# EAGLE design LSGTB (EAGLE 6.5.0)
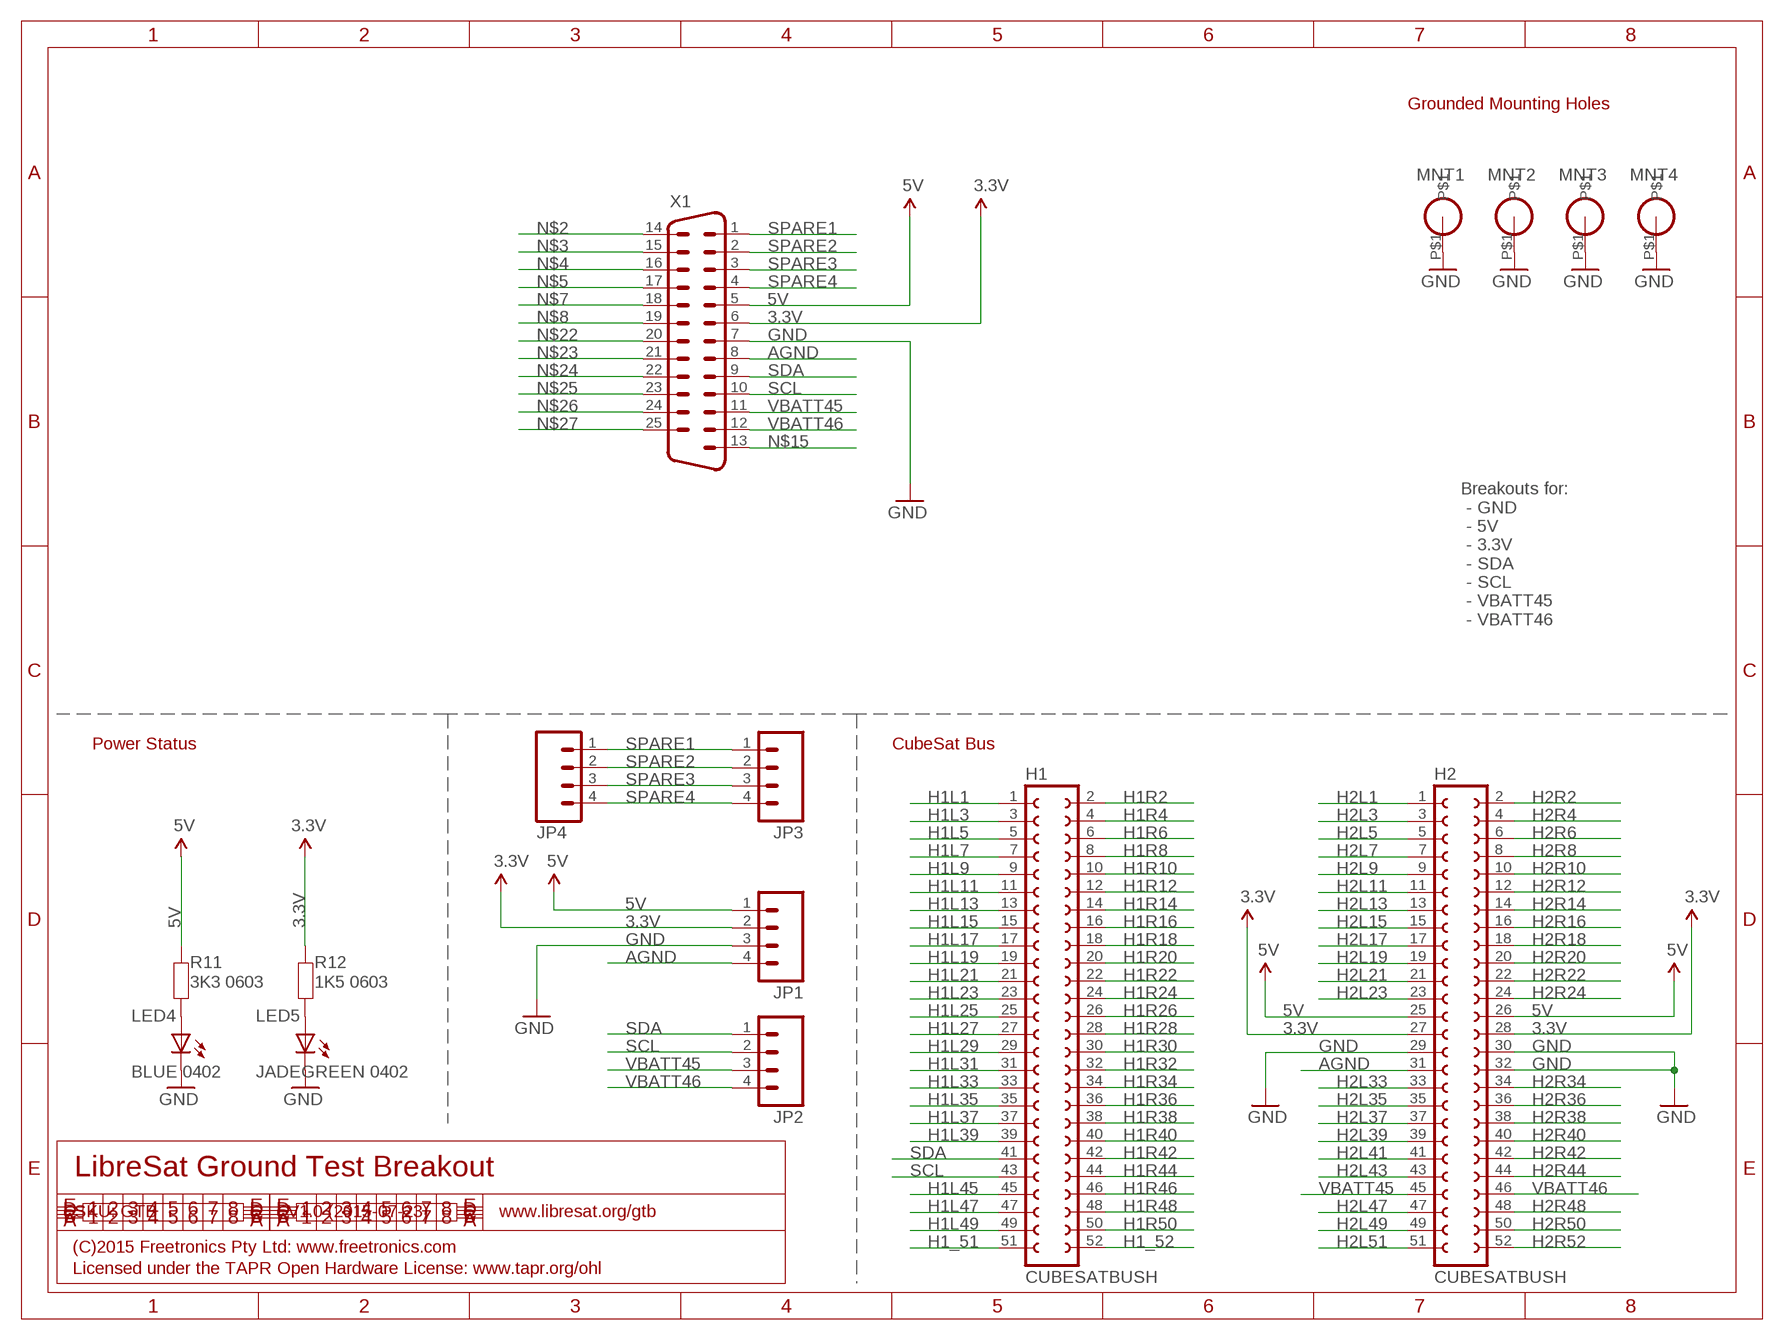
[diagram p0: schematic, sheet 1]

## Parts
H1  CUBESATBUSH  [CUBESATBUS]
H2  CUBESATBUSH  [CUBESATBUS]
JP1  M04SCREW  [SCREWTERMINAL-3.5MM-4]
JP2  M04SCREW  [SCREWTERMINAL-3.5MM-4]
JP3  M04SCREW  [SCREWTERMINAL-3.5MM-4]
JP4  M04PTH  [1X04]
LED4  BLUE 0402  LED0603  [LED-0603]
LED5  JADEGREEN 0402  LED0603  [LED-0603]
MNT1  HOLE3.2MM  [HOLE32]
MNT2  HOLE3.2MM  [HOLE32]
MNT3  HOLE3.2MM  [HOLE32]
MNT4  HOLE3.2MM  [HOLE32]
R11  3K3 0603  RESISTOR0603  [0603]
R12  1K5 0603  RESISTOR0603  [0603]
X1  DB25HP  [M25HP]

## Nets
3.3V: H2.27 H2.28 JP1.2 R12.1 X1.6
5V: H2.25 H2.26 JP1.1 R11.1 X1.5
AGND: H2.31 JP1.4 X1.8
GND: H2.29 H2.30 H2.32 JP1.3 LED4.C LED5.C MNT1.P$1 MNT2.P$1 MNT3.P$1 MNT4.P$1 X1.7
H1_51: H1.51
H1_52: H1.52
H1L1: H1.1
H1L3: H1.3
H1L5: H1.5
H1L7: H1.7
H1L9: H1.9
H1L11: H1.11
H1L13: H1.13
H1L15: H1.15
H1L17: H1.17
H1L19: H1.19
H1L21: H1.21
H1L23: H1.23
H1L25: H1.25
H1L27: H1.27
H1L29: H1.29
H1L31: H1.31
H1L33: H1.33
H1L35: H1.35
H1L37: H1.37
H1L39: H1.39
H1L45: H1.45
H1L47: H1.47
H1L49: H1.49
H1R2: H1.2
H1R4: H1.4
H1R6: H1.6
H1R8: H1.8
H1R10: H1.10
H1R12: H1.12
H1R14: H1.14
H1R16: H1.16
H1R18: H1.18
H1R20: H1.20
H1R22: H1.22
H1R24: H1.24
H1R26: H1.26
H1R28: H1.28
H1R30: H1.30
H1R32: H1.32
H1R34: H1.34
H1R36: H1.36
H1R38: H1.38
H1R40: H1.40
H1R42: H1.42
H1R44: H1.44
H1R46: H1.46
H1R48: H1.48
H1R50: H1.50
H2L1: H2.1
H2L3: H2.3
H2L5: H2.5
H2L7: H2.7
H2L9: H2.9
H2L11: H2.11
H2L13: H2.13
H2L15: H2.15
H2L17: H2.17
H2L19: H2.19
H2L21: H2.21
H2L23: H2.23
H2L33: H2.33
H2L35: H2.35
H2L37: H2.37
H2L39: H2.39
H2L41: H2.41
H2L43: H2.43
H2L47: H2.47
H2L49: H2.49
H2L51: H2.51
H2R2: H2.2
H2R4: H2.4
H2R6: H2.6
H2R8: H2.8
H2R10: H2.10
H2R12: H2.12
H2R14: H2.14
H2R16: H2.16
H2R18: H2.18
H2R20: H2.20
H2R22: H2.22
H2R24: H2.24
H2R34: H2.34
H2R36: H2.36
H2R38: H2.38
H2R40: H2.40
H2R42: H2.42
H2R44: H2.44
H2R48: H2.48
H2R50: H2.50
H2R52: H2.52
N$1: LED5.A R12.2
N$2: X1.14
N$3: X1.15
N$4: X1.16
N$5: X1.17
N$6: LED4.A R11.2
N$7: X1.18
N$8: X1.19
N$15: X1.13
N$22: X1.20
N$23: X1.21
N$24: X1.22
N$25: X1.23
N$26: X1.24
N$27: X1.25
SCL: H1.43 JP2.2 X1.10
SDA: H1.41 JP2.1 X1.9
SPARE1: JP3.1 JP4.1 X1.1
SPARE2: JP3.2 JP4.2 X1.2
SPARE3: JP3.3 JP4.3 X1.3
SPARE4: JP3.4 JP4.4 X1.4
VBATT45: H2.45 JP2.3 X1.11
VBATT46: H2.46 JP2.4 X1.12

## Notes on the sheet
- Grounded Mounting Holes
- Breakouts for:
   - GND
   - 5V
   - 3.3V
   - SDA
   - SCL
   - VBATT45
   - VBATT46
- Power Status | CubeSat Bus
- LibreSat Ground Test Breakout
- SKU: GTB | V1.0 (2015-07-23) | www.libresat.org/gtb
- (C)2015 Freetronics Pty Ltd: www.freetronics.com
- Licensed under the TAPR Open Hardware License: www.tapr.org/ohl

## Library data of the parts
H1 H2 = freetronics-jon:CUBESATBUS
JP1-JP4 = freetronics-original:M04: Header 4 Standard 4-pin 0.1" header. Use with straight break away headers (SKU : PRT-00116), right angle break away headers (PRT-00553), swiss pins (PRT-00743), machine pins (PRT-00117), and female headers (PRT-00115). Molex polarized connector foot print use with SKU : PRT-08231 with associated crimp pins and housings.
LED4 LED5 = freetronics-jon:LED: LEDs Standard schematic elements and footprints for 5mm, 3mm, 1206, and 0603 sized LEDs. 5mm - Spark Fun Electronics SKU : COM-00529 (and others)
MNT1-MNT4 = freetronics-jon:HOLE
R11 R12 = freetronics-jon:RESISTOR: Resistor Basic schematic elements and footprints for 0603, 1206, and PTH 1/10th watt (small) resistors.
X1 = freetronics-original:DB25: SUB-D

## Net classes
0 default: width 0.152 mm, drill 0.241 mm, clearance 0.152 mm

## Board
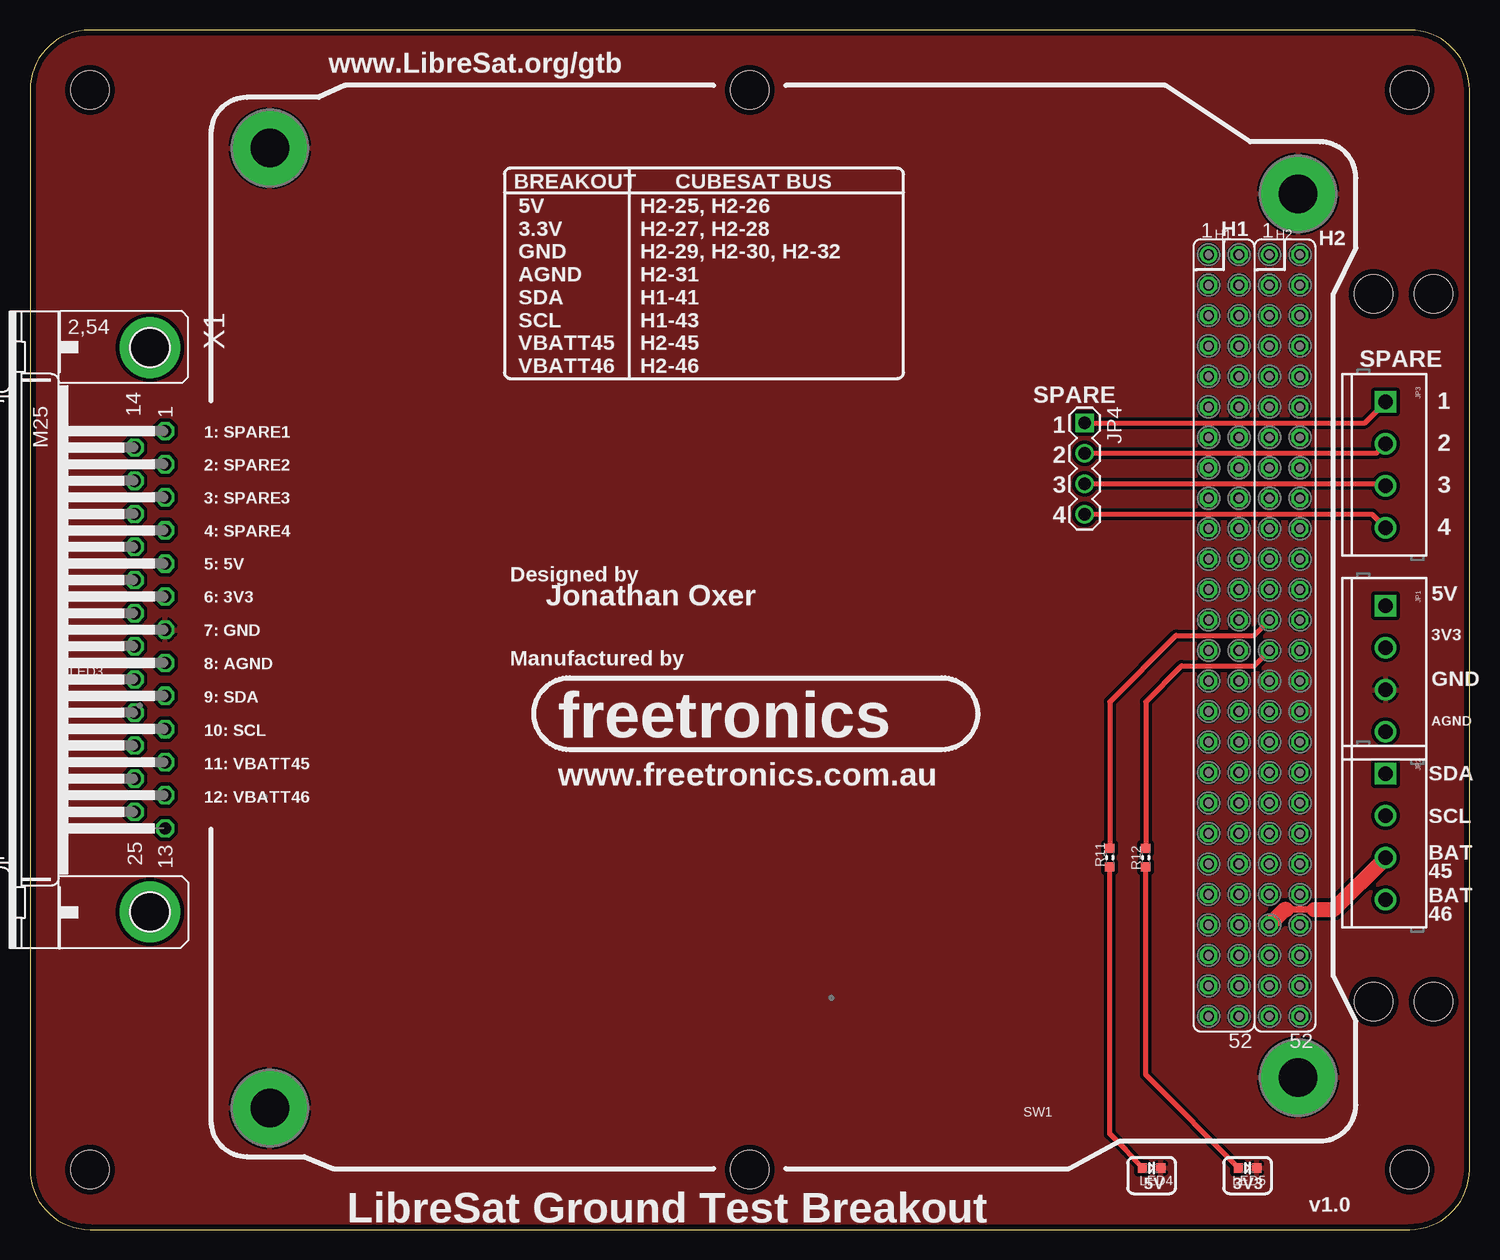
[diagram p1: board, top side]
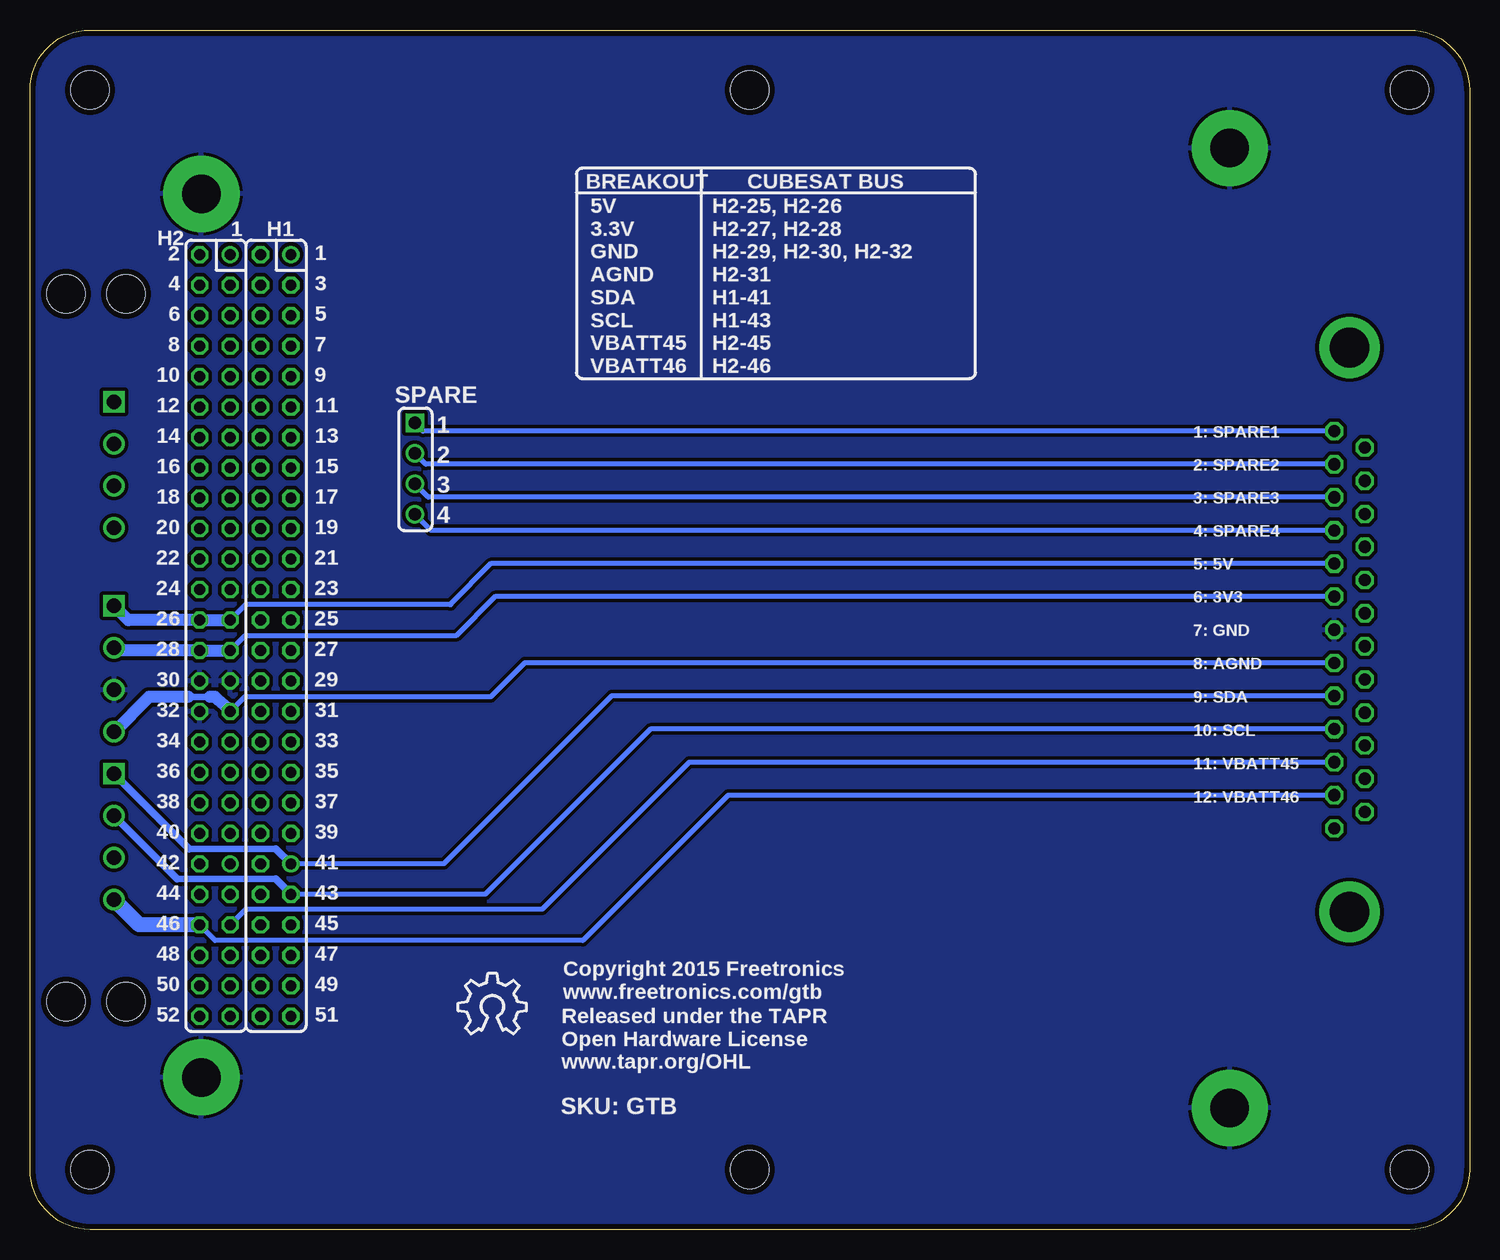
[diagram p2: board, bottom side, seen from below]

Size 120 x 100 mm. Coordinates in mm from the lower left corner, seen from the top.
Outline: 5,100 arc90 0,95 0,5 arc90 5,0 115,0 arc90 120,5 120,95 arc90 115,100 5,100
Copper layers (1*16): Top 0.035mm / dielectric 1.5mm / Bottom 0.035mm
Design rules "default *": minimum track width 6mil, minimum drill 19mil, track to track 6mil, track to pad 12mil, pad to pad 12mil, via to via 12mil, smd to smd 8mil, copper to edge 18mil, drill to drill 8mil, minimum pad ring 10mil, minimum via ring 8mil, stop-mask expansion 4mil, vias tented up to drill 20mil, thermal gap 10mil
Holes 3.2 mm at 5,95 115,95 5,5 115,5 117,78 112,78 112,19 117,19 60,95 60,5

### Footprints (pad centres in the part's own frame; a part is rotated, then mirrored left to right if it is on the bottom)
CUBESATBUS = drill 0.914: 1 -31.75,-1.27; 41 19.05,-1.27 | drill 0.914 octagon: 2 -31.75,1.27; 3 -29.21,-1.27; 4 -29.21,1.27; 5 -26.67,-1.27; 6 -26.67,1.27; 7 -24.13,-1.27; 8 -24.13,1.27; 9 -21.59,-1.27; 10 -21.59,1.27; 11 -19.05,-1.27; 12 -19.05,1.27; 13 -16.51,-1.27; 14 -16.51,1.27; 15 -13.97,-1.27; 16 -13.97,1.27; 17 -11.43,-1.27; 18 -11.43,1.27; 19 -8.89,-1.27; 20 -8.89,1.27; 21 -6.35,-1.27; 22 -6.35,1.27; 23 -3.81,-1.27; 24 -3.81,1.27; 25 -1.27,-1.27; 26 -1.27,1.27; 27 1.27,-1.27; 28 1.27,1.27; 29 3.81,-1.27; 30 3.81,1.27; 31 6.35,-1.27; 32 6.35,1.27; 33 8.89,-1.27; 34 8.89,1.27; 35 11.43,-1.27; 36 11.43,1.27; 37 13.97,-1.27; 38 13.97,1.27; 39 16.51,-1.27; 40 16.51,1.27; 42 19.05,1.27; 43 21.59,-1.27; 44 21.59,1.27; 45 24.13,-1.27; 46 24.13,1.27; 47 26.67,-1.27; 48 26.67,1.27; 49 29.21,-1.27; 50 29.21,1.27; 51 31.75,-1.27; 52 31.75,1.27
SCREWTERMINAL-3.5MM-4 = drill 1.2 square: 1 0,0 | drill 1.2: 2 3.5,0; 3 7,0; 4 10.5,0
1X04 = drill 1.016 square: 1 0,0 | drill 1.016: 2 2.54,0; 3 5.08,0; 4 7.62,0
LED-0603 = smd 0.762 x 0.762: A -0.762,0; C 0.762,0
HOLE32 = drill 3.2 pad 6.35: P$1 0,0
0603 = smd 0.762 x 0.762: 1 -0.762,0; 2 0.762,0
M25HP = drill 1.016 octagon: 1 -16.561,1.27; 2 -13.792,1.27; 3 -11.049,1.27; 4 -8.28,1.27; 5 -5.512,1.27; 6 -2.769,1.27; 7 0,1.27; 8 2.769,1.27; 9 5.512,1.27; 10 8.28,1.27; 11 11.049,1.27; 12 13.792,1.27; 13 16.561,1.27; 14 -15.189,-1.27; 15 -12.421,-1.27; 16 -9.652,-1.27; 17 -6.909,-1.27; 18 -4.14,-1.27; 19 -1.372,-1.27; 20 1.372,-1.27; 21 4.14,-1.27; 22 6.909,-1.27; 23 9.652,-1.27; 24 12.421,-1.27; 25 15.189,-1.27 | drill 3.302 pad 5.08: G1 -23.52,0; G2 23.52,0

### Placement (x,y rotation side)
H1  99.52,49.53 270 top
H2  104.6,49.53 270 top
JP1  113,52 270 top
JP2  113,38 270 top
JP3  113,69 270 top
JP4  87.92,67.25 270 top
LED4  93.5,5.13 0 top
LED5  101.5,5.13 0 top
MNT1  19.99,90.15 0 top
MNT2  105.71,86.34 0 top
MNT3  105.71,12.68 0 top
MNT4  19.99,10.13 0 top
R11  90,31 270 top
R12  93,31 270 top
U$2  [OSHW_10X200_NOTEXT]  84.3,16.31 0 bottom
X1  10,50 270 top

### Tracks (layer width: path | path; a pad name or v marks a point on that pad's centre or on a via)
3.3V
  Top 0.406: H2.27 102.06,46.99 95.99,46.99 93,44 R12.1
  Bottom 0.406: H2.27 102.09,49.5 84.5,49.5 81.23,52.77 X1.6
  Bottom 1.016: H2.27 H2.28 112.76,48.26 JP1.2
5V
  Top 0.406: H2.25 102.06,49.53 95.53,49.53 90,44 R11.1
  Bottom 0.406: 84.9,52.1 85,52.1 | 85,52.1 102.03,52.1 H2.25 | X1.5 81.59,55.51 85,52.1
  Bottom 1.016: H2.25 H2.26 111.8,50.8 JP1.1
AGND
  Bottom 0.406: H2.31 102.11,44.4 81.6,44.4 78.77,47.23 X1.8
  Bottom 0.55: 106.8,44.4 104.6,44.4
  Bottom 1.016: H2.31 103.33,43.33 104.6,44.4 105,44.4 | 106.8,44.4 110.1,44.4 JP1.4
GND
  pour Bottom (isolate 0.305): 0,95 arc-90 5,100 115,100 arc-90 120,95 120,5 arc-90 115,0 5,0 arc-90 0,5
  pour Top (isolate 0.305): 0,95 arc-90 5,100 115,100 arc-90 120,95 120,5 arc-90 115,0 5,0 arc-90 0,5
N$1
  Top 0.406: LED5.A 93.35,12.56 93,12.91 R12.2
N$6
  Top 0.406: LED4.A 91.35,6.63 90,7.97 R11.2
SCL
  Bottom 0.406: X1.10 68.28,41.72 82.06,27.94 H1.43
  Bottom 0.55: 107.71,29.21 99.52,29.21
  Bottom 0.61: H1.43 99.52,29.21 | 107.71,29.21 JP2.2
SDA
  Bottom 0.406: X1.9 71.51,44.49 85.52,30.48 H1.41
  Bottom 0.55: 99.52,31.75 106.75,31.75
  Bottom 0.61: H1.41 99.52,31.75 | 106.75,31.75 JP2.1
SPARE1
  Top 0.406: JP4.1 111.25,67.25 JP3.1
  Bottom 0.406: X1.1 87.23,66.56 JP4.1
SPARE2
  Top 0.406: JP4.2 112.21,64.71 JP3.2
  Bottom 0.406: X1.2 87,63.79 JP4.2
SPARE3
  Top 0.406: JP4.3 112.83,62.17 JP3.3
  Bottom 0.406: X1.3 86.8,61.05 JP4.3
SPARE4
  Top 0.406: JP4.4 111.87,59.63 JP3.4
  Bottom 0.406: X1.4 86.57,58.28 JP4.4
VBATT45
  Top 0.55: 107.03,26.67 104.74,26.67
  Top 1.27: 104.74,26.67 104.6,26.67 H2.45 | 107.03,26.67 108.67,26.67 JP2.3
  Bottom 0.406: H2.45 102.03,26.7 77.3,26.7 65.05,38.95 X1.11
VBATT46
  Bottom 0.406: H2.46 104.57,24.1 73.9,24.1 61.79,36.21 X1.12
  Bottom 1.27: H2.46 110.9,25.4 JP2.4

### Text on the board
tPlace: www.LibreSat.org/gtb | BREAKOUT | CUBESAT BUS | H1 | H2 | SPARE | 5V / 3.3V / GND / AGND / SDA / SCL / VBATT45 / VBATT46 | H2-25, H2-26 / H2-27, H2-28 / H2-29, H2-30, H2-32 / H2-31 / H1-41 / H1-43 / H2-45 / H2-46 | SPARE | 1 | 1: SPARE1 | 1 | 2 | 2 | 2: SPARE2 | 3 | 3 | 3: SPARE3 | 4 | 4: SPARE4 | 4 | 5: 5V | Designed by | 6: 3V3 | Jonathan Oxer | 5V | 7: GND | 3V3 | 8: AGND | Manufactured by | GND | 9: SDA | AGND | 10: SCL | freetronics | 11: VBATT45 | www.freetronics.com.au | SDA | 12: VBATT46 | SCL | BAT / 45 | BAT / 46 | 5V | 3V3 | LibreSat Ground Test Breakout | v1.0
bPlace: CUBESAT BUS | BREAKOUT | H1 | 1 | H2 | 1 | 2 | 3 | 4 | 5 | 6 | 7 | 8 | H2-25, H2-26 / H2-27, H2-28 / H2-29, H2-30, H2-32 / H2-31 / H1-41 / H1-43 / H2-45 / H2-46 | 5V / 3.3V / GND / AGND / SDA / SCL / VBATT45 / VBATT46 | 9 | 10 | SPARE | 11 | 12 | 1: SPARE1 | 1 | 13 | 14 | 2 | 2: SPARE2 | 15 | 16 | 3 | 3: SPARE3 | 17 | 18 | 4 | 4: SPARE4 | 19 | 20 | 5: 5V | 21 | 22 | 23 | 24 | 6: 3V3 | 25 | 26 | 7: GND | 27 | 28 | 8: AGND | 29 | 30 | 9: SDA | 31 | 32 | 10: SCL | 33 | 34 | 11: VBATT45 | 35 | 36 | 12: VBATT46 | 37 | 38 | 39 | 40 | 41 | 42 | 43 | 44 | 45 | 46 | 47 | 48 | 49 | 50 | Copyright 2015 Freetronics / www.freetronics.com/gtb | 51 | 52 | Released under the TAPR / Open Hardware License / www.tapr.org/OHL | SKU: GTB
tNames: LED3 | SW1